# EAGLE design hv_filter (EAGLE 7.5.0)
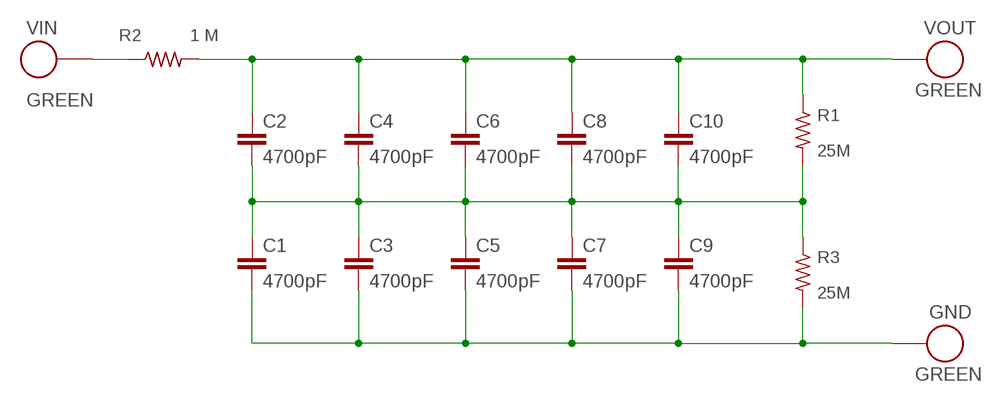
[diagram p0: schematic, sheet 1]

## Parts
C1  4700pF  4700PF6KV  [4700PF6KV]
C2  4700pF  4700PF6KV  [4700PF6KV]
C3  4700pF  4700PF6KV  [4700PF6KV]
C4  4700pF  4700PF6KV  [4700PF6KV]
C5  4700pF  4700PF6KV  [4700PF6KV]
C6  4700pF  4700PF6KV  [4700PF6KV]
C7  4700pF  4700PF6KV  [4700PF6KV]
C8  4700pF  4700PF6KV  [4700PF6KV]
C9  4700pF  4700PF6KV  [4700PF6KV]
C10  4700pF  4700PF6KV  [4700PF6KV]
GND  GREEN  BANANA_JACK_GREEN  [AWG22]
R1  25M  25MOHM  [25MOHM]
R2  1 M  1M25KV  [1M20KV]
R3  25M  25MOHM  [25MOHM]
VIN  GREEN  BANANA_JACK_GREEN  [AWG22]
VOUT  GREEN  BANANA_JACK_GREEN  [AWG22]

## Nets
N$3: R2.P$1 VIN.P$1
N$5: C2.P$1 C4.P$1 C6.P$1 C8.P$1 C10.P$1 R1.P$1 R2.P$2 VOUT.P$1
N$6: C1.P$1 C2.P$2 C3.P$1 C4.P$2 C5.P$1 C6.P$2 C7.P$1 C8.P$2 C9.P$1 C10.P$2 R1.P$2 R3.P$1
N$7: C1.P$2 C3.P$2 C5.P$2 C7.P$2 C9.P$2 GND.P$1 R3.P$2

## Library data of the parts
C1-C10 = keiths:4700PF6KV: Ceramic Disc Capacitors 4700pF 6Kvolts 20%
GND VIN VOUT = keiths:BANANA_JACK_GREEN: Banana Jack Green, Solder Tab; MPN: 108-0904-001
R1 R3 = keiths:25MOHM: 25 M ohm HV resistor
R2 = keiths:1M25KV: 1 M 25 KV resistor

## Board
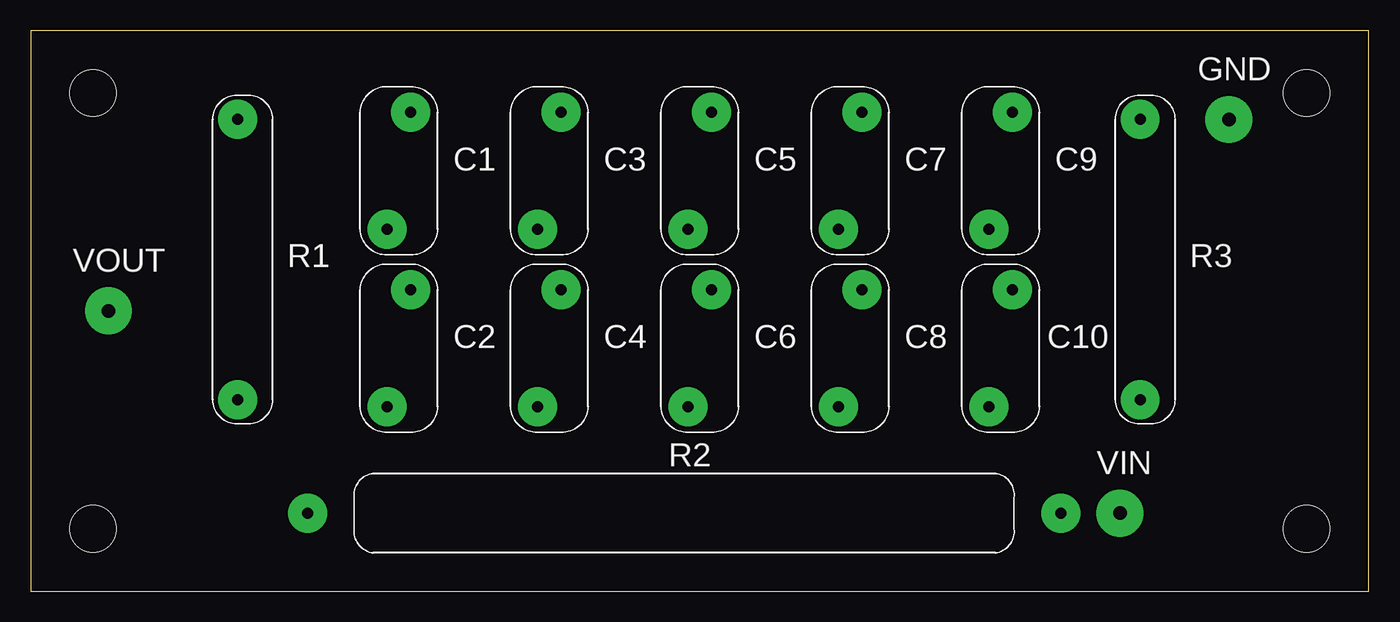
[diagram p1: board, top side]
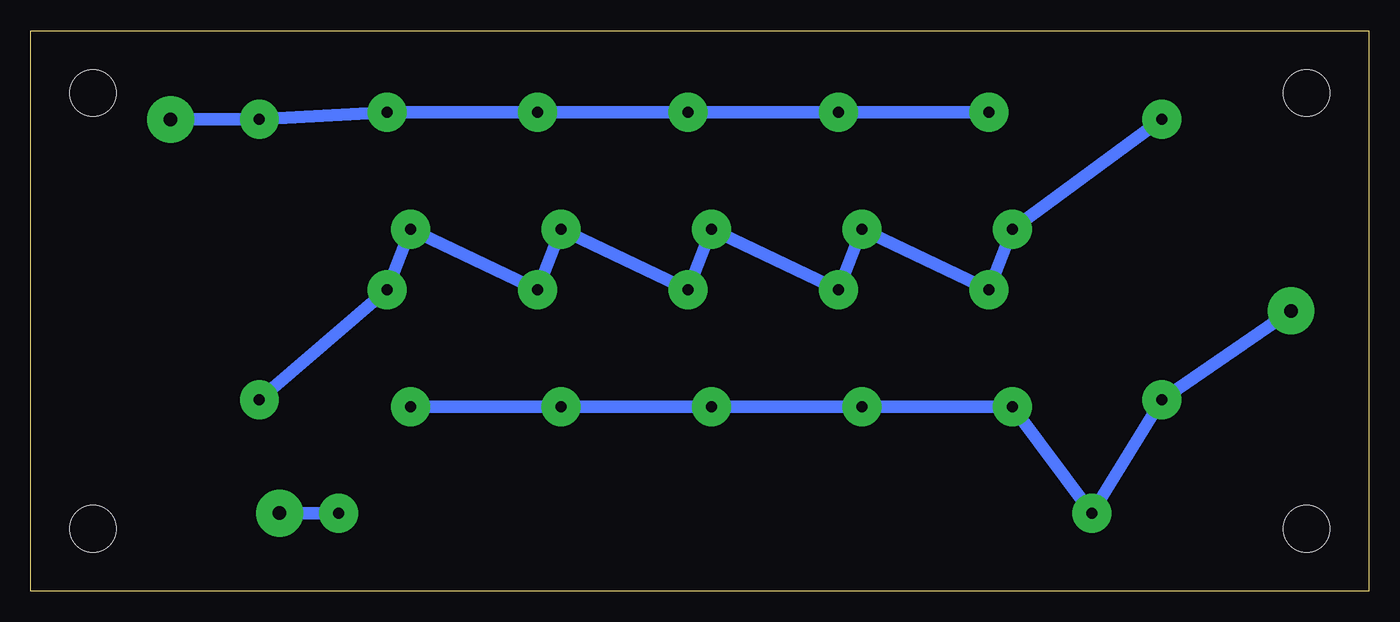
[diagram p2: board, bottom side, seen from below]

Size 109.22 x 45.72 mm. Coordinates in mm from the lower left corner, seen from the top.
Outline: 0,0 109.22,0 109.22,45.72 0,45.72 0,0
Copper layers (1*16): Top 0.035mm / dielectric 1.5mm / Bottom 0.035mm
Design rules "default": minimum track width 10mil, minimum drill 24mil, track to track 8mil, track to pad 8mil, pad to pad 8mil, via to via 8mil, smd to smd 8mil, copper to edge 40mil, drill to drill 8mil, minimum pad ring 10mil, minimum via ring 8mil, stop-mask expansion 4mil, vias tented up to drill 0mil, thermal gap 10mil
Holes 3.8 mm at 5.08,5.08 5.08,40.64 104.14,40.64 104.14,5.08

### Footprints (pad centres in the part's own frame; a part is rotated, then mirrored left to right if it is on the bottom)
4700PF6KV = drill 0.9 pad 3.175: P$1 4.763,-0.953; P$2 -4.763,0.953
AWG22 = drill 1.1 pad 3.81: P$1 0,0
25MOHM = drill 0.9 pad 3.175: P$1 11.43,-0.889; P$2 -11.43,-0.889
1M20KV = drill 0.9 pad 3.175: P$1 30.734,0; P$2 -30.734,0

### Placement (x,y rotation side)
C1  30.06,34.29 270 top
C2  30.06,19.81 270 top
C3  42.33,34.29 270 top
C4  42.33,19.81 270 top
C5  54.61,34.29 270 top
C6  54.61,19.81 270 top
C7  66.89,34.29 270 top
C8  66.89,19.81 270 top
C9  79.16,34.29 270 top
C10  79.16,19.81 270 top
GND  97.79,38.48 0 top
R1  17.78,27.05 270 top
R2  53.34,6.35 0 top
R3  91.44,27.05 270 top
VIN  88.9,6.35 0 top
VOUT  6.35,22.86 0 top

### Tracks (layer width: path | path; a pad name or v marks a point on that pad's centre or on a via)
N$3
  Bottom 1.016: VIN.P$1 R2.P$1
N$5
  Bottom 1.016: VOUT.P$1 R1.P$1 R2.P$2 C2.P$1 C4.P$1 C6.P$1 C8.P$1 C10.P$1
N$6
  Bottom 1.016: R3.P$1 C10.P$2 C9.P$1 C8.P$2 C7.P$1 C6.P$2 C5.P$1 C4.P$2 C3.P$1 C2.P$2 C1.P$1 R1.P$2
N$7
  Bottom 1.016: C1.P$2 C3.P$2 C5.P$2 C7.P$2 C9.P$2 R3.P$2 GND.P$1